# Altium schematic sheet 9040_LCD.SchDoc
size A4
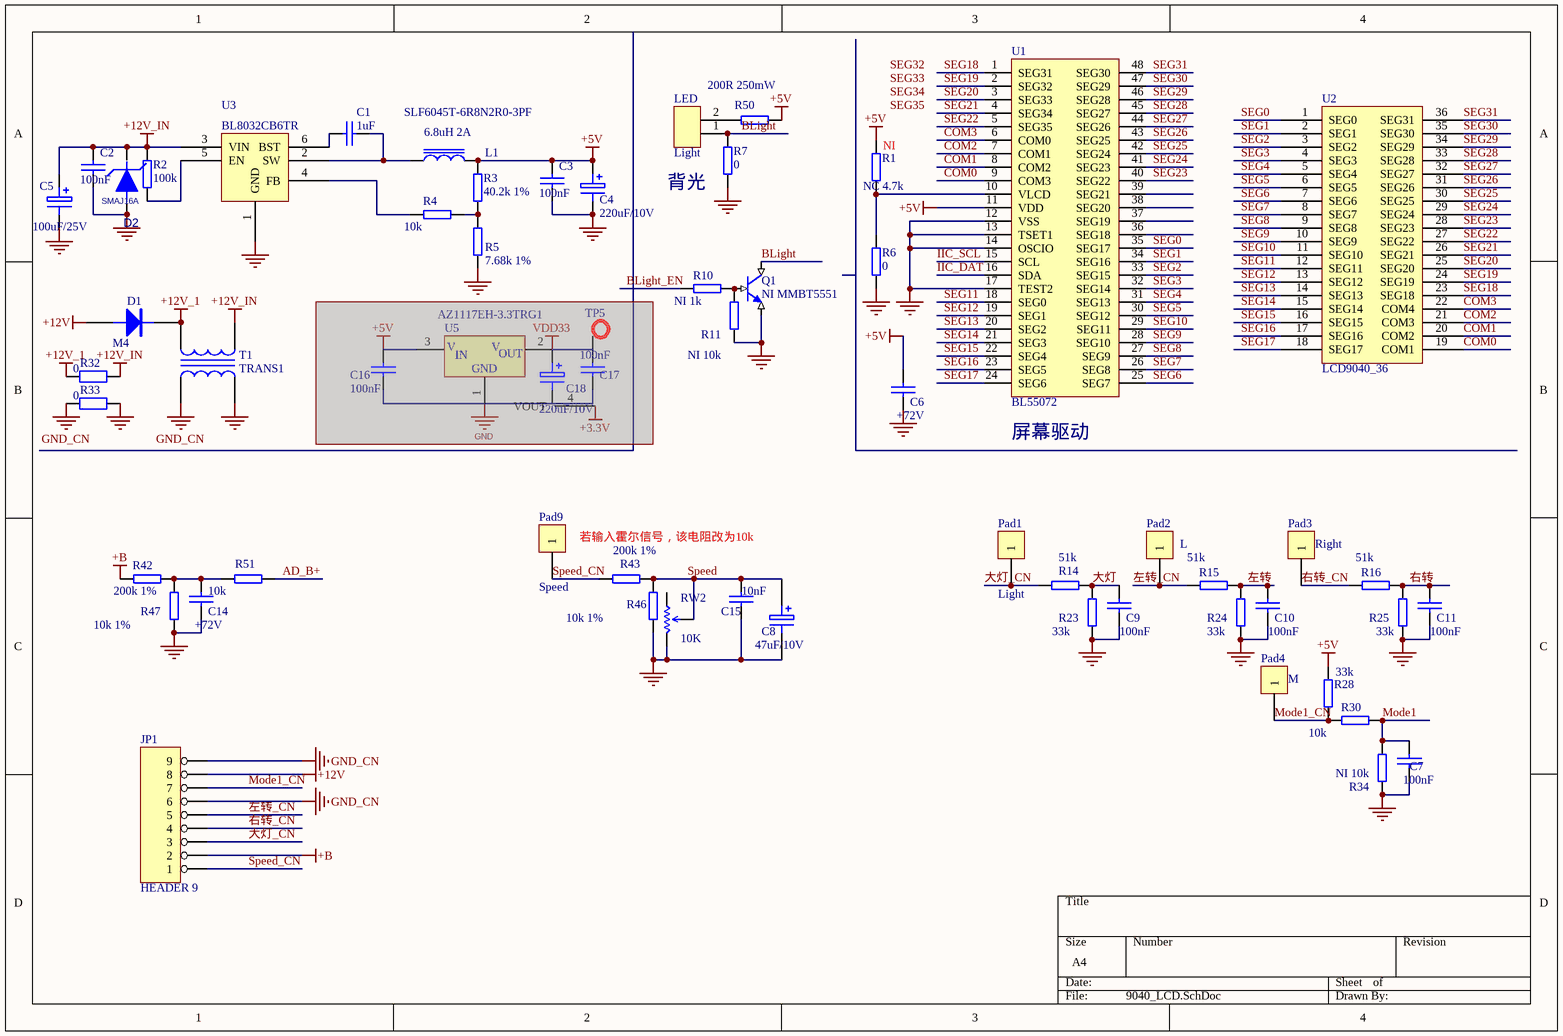
[diagram p0: 9040_LCD.SchDoc]

## Parts
C1  1uF  [0805]
C2  100nF  [0805]
C3  100nF  [0805]
C4  220uF/10V  [CE-D6.4]
C5  100uF/25V  [RB.2/.4]
C6  +72V  [0805]
C7  100nF  [0805]
C8  47uF/10V  [RB.1/.2]
C9  100nF  [0805]
C10  100nF  [0805]
C11  100nF  [0805]
C14  +72V  [0805]
C15  10nF  [0603]
C16  100nF  [0805]  (masked out: inside a compile mask, not in the netlist)
C17  100nF  [0805]  (masked out: inside a compile mask, not in the netlist)
C18  220uF/10V  [CE-D6.4]  (masked out: inside a compile mask, not in the netlist)
D1  M4  [SMA]
D2  SMAJ16A  [SMA]
JP1  HEADER 9  [HDR1X9]
L1  SLF6045T-6R8N2R0-3PF  [L6025]
LED  Light  [sip2]
Pad1  Light  [PAD]
Pad2  L  [PAD]
Pad3  Right  [PAD]
Pad4  M  [PAD]
Pad9  Speed  [PAD]
Q1  NI MMBT5551  [SOT-23]
R1  NC 4.7k  [0603]
R2  100k  [0805]
R3  40.2k 1%  [0805]
R4  10k  [0603]
R5  7.68k 1%  [0603]
R6  0  [0805]
R7  0  [0805]
R10  NI 1k  [0805]
R11  NI 10k  [0805]
R14  51k  [0805]
R15  51k  [0805]
R16  51k  [0805]
R23  33k  [0805]
R24  33k  [0805]
R25  33k  [0805]
R28  33k  [0805]
R30  10k  [0805]
R32  0  [0805]
R33  0  [0805]
R34  NI 10k  [0805]
R42  200k 1%  [0805]
R43  200k 1%  [0805]
R46  10k 1%  [0805]
R47  10k 1%  [0805]
R50  200R 250mW  [1206]
R51  10k  [0805]
RW2  10K  [RW-3*3SMD]
T1  TRANS1  [L6*6]
TP5  (no value)  [TestPad]  (masked out: inside a compile mask, not in the netlist)
U1  BL55072  [TSSOP-48]
U2  LCD9040_36  [LCD9040_36FM]
U3  BL8032CB6TR  [SOT23-6-BL]
U5  AZ1117EH-3.3TRG1  [SOT223]  (masked out: inside a compile mask, not in the netlist)

## Nets
+5V: C3.1 C4.1 C6.1 L1.2 R1.1 R3.1 R28.1 R50.1 U1.11(VDD)
+12V: D1.1(A) JP1.8
+12V_1: D1.2(K) R32.2 T1.2
+12V_IN: C2.1 C5.1 D2.2 R2.1 R32.1 T1.4 U3.3(VIN)
+B: JP1.2 R42.2
GND: C2.2 C3.2 C4.2 C5.2 C6.2 C7.2 C8.2 C9.2 C10.2 C11.2 C14.2 C15.2 D2.1 Q1.2(E) R5.1 R6.2 R7.2 R11.1 R23.2 R24.2 R25.2 R33.1 R34.2 R46.2 R47.2 RW2.1 T1.3 U1.12(VSS) U1.13(TSET1) U1.14(OSCIO) U1.17(TEST2) U3.1(GND)
GND_CN: JP1.6 JP1.9 R33.2 T1.1
AD_B+: R51.1
BLight: LED.1 Q1.3(C) R7.1
BLight_EN: R10.1
COM0: U1.9(COM3) U2.19(COM1)
COM1: U1.8(COM2) U2.20(COM2)
COM2: U1.7(COM1) U2.21(COM3)
COM3: U1.6(COM0) U2.22(COM4)
IIC_DAT: U1.16(SDA)
IIC_SCL: U1.15(SCL)
Mode1: C7.1 R30.1 R34.1
Mode1_CN: JP1.7 Pad4.1 R28.2 R30.2
SEG0: U1.35(SEG17) U2.1(SEG0)
SEG1: U1.34(SEG16) U2.2(SEG1)
SEG2: U1.33(SEG15) U2.3(SEG2)
SEG3: U1.32(SEG14) U2.4(SEG3)
SEG4: U1.31(SEG13) U2.5(SEG4)
SEG5: U1.30(SEG12) U2.6(SEG5)
SEG6: U1.25(SEG7) U2.7(SEG6)
SEG7: U1.26(SEG8) U2.8(SEG7)
SEG8: U1.27(SEG9) U2.9(SEG8)
SEG9: U1.28(SEG10) U2.10(SEG9)
SEG10: U1.29(SEG11) U2.11(SEG10)
SEG11: U1.18(SEG0) U2.12(SEG11)
SEG12: U1.19(SEG1) U2.13(SEG12)
SEG13: U1.20(SEG2) U2.14(SEG13)
SEG14: U1.21(SEG3) U2.15(SEG14)
SEG15: U1.22(SEG4) U2.16(SEG15)
SEG16: U1.23(SEG5) U2.17(SEG16)
SEG17: U1.24(SEG6) U2.18(SEG17)
SEG18: U1.1(SEG31) U2.23(SEG18)
SEG19: U1.2(SEG32) U2.24(SEG19)
SEG20: U1.3(SEG33) U2.25(SEG20)
SEG21: U1.4(SEG34) U2.26(SEG21)
SEG22: U1.5(SEG35) U2.27(SEG22)
SEG23: U1.40(SEG22) U2.28(SEG23)
SEG24: U1.41(SEG23) U2.29(SEG24)
SEG25: U1.42(SEG24) U2.30(SEG25)
SEG26: U1.43(SEG25) U2.31(SEG26)
SEG27: U1.44(SEG26) U2.32(SEG27)
SEG28: U1.45(SEG27) U2.33(SEG28)
SEG29: U1.46(SEG28) U2.34(SEG29)
SEG30: U1.47(SEG29) U2.35(SEG30)
SEG31: U1.48(SEG30) U2.36(SEG31)
Speed: C8.1 C15.1 R43.1 R46.1 RW2.3
Speed_CN: JP1.1 Pad9.1 R43.2
右转: C11.1 R16.1 R25.1
右转_CN: JP1.4 Pad3.1 R16.2
大灯: C9.1 R14.1 R23.1
大灯_CN: JP1.3 Pad1.1 R14.2
左转: C10.1 R15.1 R24.1
左转_CN: JP1.5 Pad2.1 R15.2
NetC1_1: C1.1 L1.1 U3.2(SW)
NetC1_2: C1.2 U3.6(BST)
NetC14_1: C14.1 R42.1 R47.1 R51.2
NetLED_2: LED.2 R50.2
NetQ1_1: Q1.1(B) R10.2 R11.2
NetR1_2: R1.2 R6.1 U1.10(VLCD)
NetR2_2: R2.2 U3.5(EN)
NetR3_2: R3.2 R4.1 R5.2
NetR4_2: R4.2 U3.4(FB)

Not connected (* = marked no-connect by the designer): RW2 2; U1 36(SEG18) 37(SEG19) 38(SEG20) 39(SEG21)

## Notes on the sheet
- (near R1) NI
- 背光
- (near U1) 屏幕驱动
- 若输入霍尔信号，该电阻改为10k
- Labels drawn without touching a wire or pin: SEG32, SEG33, SEG34, SEG35
- (in symbol 78L05) V; IN; OUT
- (in symbol WHLL) 6.8uH 2A

## Library data of the parts
C1 = WHLCAP
C2 C3 C6 C7 C9-C11 C14-C17 = CAP: Capacitor
C4 C5 C18 = ELECTRO1: Electrolytic Capacitor
C8 = ELECTRO1: Electrolytic Capacitor; Pressure: 25V
D1 = DIODE
D2 = DO-214AC_SMAJ: 5.1V,500mW,323; Manufacture 1: VISHAY; 中文名称: 贴片TVS二极管; 物料描述: SMA-DO-214AC; Geometry.Height: 1.1mm; Value: SMAJ16A; PCB DECAL: DO-214AC_SMAJ
L1 = WHLL
LED = CON2
Pad1-Pad4 Pad9 = CON1: Connector
Q1 = 5551: NPN BJT
R1-R7 R10 R11 R14-R16 R23-R25 R28 R30 R34 R42 R43 R46 R47 R50 R51 = WHLRES
R32 R33 = Res2: Resistor; Published: 8-Jun-2000; LatestRevisionDate: 17-Jul-2002; LatestRevisionNote: Re-released for DXP Platform.; PackageReference: AXIAL-0.4; Publisher: Altium Limited
RW2 = RW1
TP5 = TEST-1
U3 = BL8032
U5 = 78L05: 3-Terminal Positive Voltage Regulator